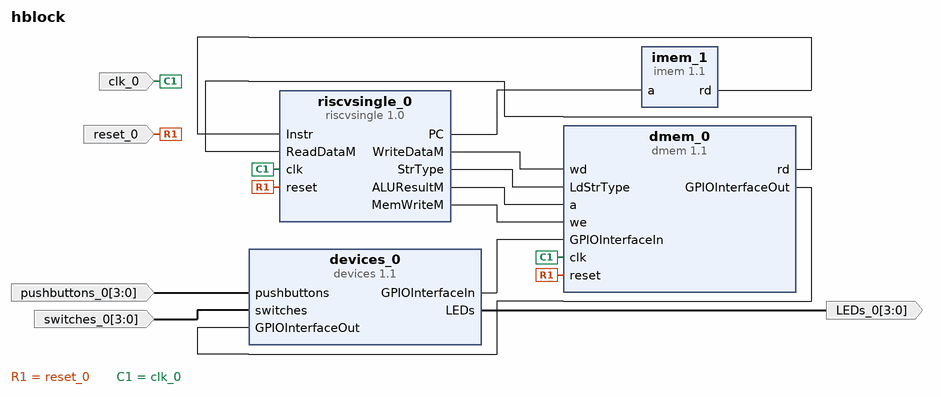
[diagram p0: block diagram of the top level]
# Vivado block design hblock, xc7z010clg400-1, Vivado 2019.2
create_bd_design hblock

create_bd_port -dir I -type clk clk_0
create_bd_port -dir I reset_0
create_bd_port -dir O -from 3 -to 0 LEDs_0
create_bd_port -dir I -from 3 -to 0 pushbuttons_0
create_bd_port -dir I -from 3 -to 0 switches_0

create_bd_cell -type ip -vlnv user.org:user:imem:1.1 imem_1
create_bd_cell -type ip -vlnv user.org:user:riscvsingle:1.0 riscvsingle_0
create_bd_cell -type ip -vlnv user.org:user:dmem:1.1 dmem_0
create_bd_cell -type ip -vlnv user.org:user:devices:1.1 devices_0

# ---- connections ----

connect_bd_net [get_bd_pins riscvsingle_0/PC] [get_bd_pins imem_1/a]
connect_bd_net [get_bd_pins imem_1/rd] [get_bd_pins riscvsingle_0/Instr]
connect_bd_net -net reset_0_1 [get_bd_ports reset_0] [get_bd_pins riscvsingle_0/reset] [get_bd_pins dmem_0/reset]
connect_bd_net -net clk_0_1 [get_bd_ports clk_0] [get_bd_pins riscvsingle_0/clk] [get_bd_pins dmem_0/clk]
connect_bd_net [get_bd_pins riscvsingle_0/WriteDataM] [get_bd_pins dmem_0/wd]
connect_bd_net [get_bd_pins riscvsingle_0/StrType] [get_bd_pins dmem_0/LdStrType]
connect_bd_net [get_bd_pins riscvsingle_0/ALUResultM] [get_bd_pins dmem_0/a]
connect_bd_net [get_bd_pins riscvsingle_0/MemWriteM] [get_bd_pins dmem_0/we]
connect_bd_net -net devices_1_GPIOInterfaceIn [get_bd_pins devices_0/GPIOInterfaceIn] [get_bd_pins dmem_0/GPIOInterfaceIn]
connect_bd_net [get_bd_pins dmem_0/rd] [get_bd_pins riscvsingle_0/ReadDataM]
connect_bd_net [get_bd_pins dmem_0/GPIOInterfaceOut] [get_bd_pins devices_0/GPIOInterfaceOut]
connect_bd_net [get_bd_pins devices_0/LEDs] [get_bd_ports LEDs_0]
connect_bd_net -net pushbuttons_0_1 [get_bd_ports pushbuttons_0] [get_bd_pins devices_0/pushbuttons]
connect_bd_net -net switches_0_1 [get_bd_ports switches_0] [get_bd_pins devices_0/switches]

validate_bd_design
save_bd_design
